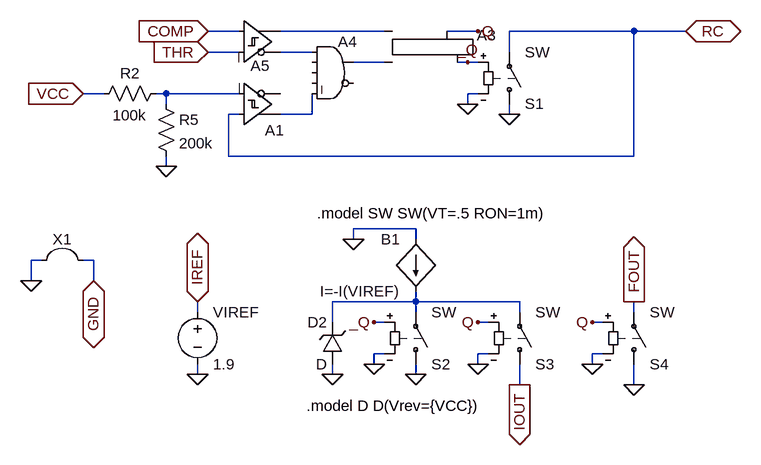
[diagram p0: schematic LM331g.asc]
LM331g.asc, the LTspice schematic file:
Version 4
SHEET 1 880 1028
WIRE 80 160 32 160
WIRE 304 160 144 160
WIRE 448 160 400 160
WIRE 688 160 496 160
WIRE 768 160 688 160
WIRE 80 192 32 192
WIRE 192 192 144 192
WIRE 496 192 496 160
WIRE 304 208 256 208
WIRE 432 208 416 208
WIRE 448 208 432 208
WIRE -128 256 -160 256
WIRE -32 256 -48 256
WIRE 80 256 -32 256
WIRE 448 256 432 256
WIRE -32 272 -32 256
WIRE 432 272 432 256
WIRE 80 288 64 288
WIRE 192 288 192 256
WIRE 192 288 144 288
WIRE 496 288 496 272
WIRE 64 352 64 288
WIRE 688 352 688 160
WIRE 688 352 64 352
WIRE -32 368 -32 352
WIRE 352 464 256 464
WIRE 256 480 256 464
WIRE 352 480 352 464
WIRE -224 512 -240 512
WIRE -144 512 -160 512
WIRE -240 544 -240 512
WIRE -144 544 -144 512
WIRE 352 576 352 560
WIRE 352 576 224 576
WIRE 512 576 352 576
WIRE 16 592 16 576
WIRE 352 592 352 576
WIRE 512 592 512 576
WIRE 688 592 688 576
WIRE 224 608 224 576
WIRE 304 608 288 608
WIRE 464 608 448 608
WIRE 640 608 624 608
WIRE 304 656 288 656
WIRE 464 656 448 656
WIRE 640 656 624 656
WIRE 288 672 288 656
WIRE 448 672 448 656
WIRE 624 672 624 656
WIRE 16 688 16 672
WIRE 224 688 224 672
WIRE 352 688 352 672
WIRE 512 704 512 672
WIRE 688 704 688 672
FLAG 432 272 0
FLAG 496 288 0
FLAG 16 688 0
FLAG 16 576 IREF
IOPIN 16 576 BiDir
FLAG 448 160 Q
FLAG 288 608 _Q
FLAG 288 672 0
FLAG 256 480 0
FLAG 448 608 Q
FLAG 448 672 0
FLAG 432 208 _Q
FLAG 352 688 0
FLAG 512 704 IOUT
IOPIN 512 704 Out
FLAG 224 688 0
FLAG 32 192 THR
IOPIN 32 192 In
FLAG 32 160 COMP
IOPIN 32 160 In
FLAG -32 368 0
FLAG -160 256 VCC
IOPIN -160 256 In
FLAG 768 160 RC
IOPIN 768 160 BiDir
FLAG 624 608 Q
FLAG 624 672 0
FLAG 688 576 FOUT
IOPIN 688 576 Out
FLAG 688 704 0
FLAG -240 544 0
FLAG -144 544 GND
IOPIN -144 544 BiDir
SYMBOL Digital\\srflop 352 112 R0
WINDOW 3 0 0 Invisible 0
SYMATTR Value TD=10n
SYMATTR InstName A3
SYMBOL sw 496 288 M180
SYMATTR InstName S1
SYMBOL Digital\\and 224 160 R0
SYMATTR InstName A4
SYMBOL voltage 16 576 R0
SYMATTR InstName VIREF
SYMATTR Value 1.9
SYMBOL sw 352 688 M180
SYMATTR InstName S2
SYMBOL bi 352 480 M0
SYMATTR InstName B1
SYMATTR Value I=-I(VIREF)
SYMBOL sw 512 688 M180
SYMATTR InstName S3
SYMBOL zener 240 672 R180
WINDOW 0 24 64 Left 2
WINDOW 3 24 0 Left 2
SYMATTR InstName D2
SYMATTR Description Diode
SYMATTR Type diode
SYMBOL Digital\\diffschmitt 80 112 R0
WINDOW 0 18 101 Left 2
WINDOW 3 8 120 Invisible 2
SYMATTR InstName A5
SYMATTR Value VT=0 VH=0
SYMBOL Digital\\diffschmitt 80 336 M180
WINDOW 3 8 -12 Invisible 2
SYMATTR Value VT=0 VH=0
SYMATTR InstName A1
SYMBOL res -144 272 R270
WINDOW 0 32 56 VTop 2
WINDOW 3 -2 56 VBottom 2
SYMATTR InstName R2
SYMATTR Value 100k
SYMBOL res -48 256 R0
SYMATTR InstName R5
SYMATTR Value 200k
SYMBOL sw 688 688 M180
SYMATTR InstName S4
SYMBOL Misc\\jumper -192 448 R0
SYMATTR InstName X1
TEXT 200 440 Left 2 !.model SW SW(VT=.5 RON=1m)
TEXT 184 736 Left 2 !.model D D(Vrev={VCC})

The netlist it stands for:
* LM331g.asc
A3 N001 N003 0 0 0 _Q Q 0 SRFLOP TD=10n
S1 0 RC _Q 0 SW
A4 N002 0 0 0 N005 0 N003 0 AND
VIREF IREF 0 1.9
S2 0 N006 _Q 0 SW
B1 0 N006 I=-I(VIREF)
S3 IOUT N006 Q 0 SW
D2 0 N006 D
A5 COMP THR 0 0 0 N002 N001 0 SCHMITT VT=0 VH=0
A1 RC N004 0 0 0 0 N005 0 SCHMITT VT=0 VH=0
R2 VCC N004 100k
R5 N004 0 200k
S4 0 FOUT Q 0 SW
.model D D
.lib standard.dio
.model SW SW(VT=.5 RON=1m)
.model D D(Vrev={VCC})
.backanno
.end